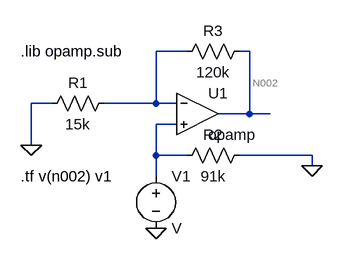
[diagram p0: schematic pag8es7p2.asc]
pag8es7p2.asc, the LTspice schematic file:
Version 4
SHEET 1 880 680
WIRE 272 -64 224 -64
WIRE 368 -64 352 -64
WIRE 64 16 32 16
WIRE 224 16 224 -64
WIRE 224 16 144 16
WIRE 256 16 224 16
WIRE 368 32 368 -64
WIRE 368 32 320 32
WIRE 400 32 368 32
WIRE 256 48 224 48
WIRE 32 80 32 16
WIRE 224 96 224 48
WIRE 272 96 224 96
WIRE 464 96 352 96
WIRE 464 112 464 96
WIRE 224 128 224 96
FLAG 32 80 0
FLAG 224 208 0
FLAG 464 112 0
SYMBOL res 48 32 R270
WINDOW 0 32 56 VTop 2
WINDOW 3 0 56 VBottom 2
SYMATTR InstName R1
SYMATTR Value 15k
SYMBOL OpAmps\\opamp 288 -32 R0
SYMATTR InstName U1
SYMBOL res 256 -48 R270
WINDOW 0 32 56 VTop 2
WINDOW 3 0 56 VBottom 2
SYMATTR InstName R3
SYMATTR Value 120k
SYMBOL voltage 224 112 R0
SYMATTR InstName V1
SYMBOL res 256 112 R270
WINDOW 0 32 56 VTop 2
WINDOW 3 0 56 VBottom 2
SYMATTR InstName R2
SYMATTR Value 91k
TEXT 16 -64 Left 2 !.lib opamp.sub
TEXT 16 128 Left 2 !.tf v(n002) v1

The netlist it stands for:
* pag8es7p2.asc
R1 0 N001 15k
XU1 N001 N003 N002 opamp Aol=100K GBW=10Meg  ; pins invin noninvin out
R3 N001 N002 120k
V1 N003 0 V
R2 N003 0 91k
.lib opamp.sub
.tf v(n002) v1
.backanno
.end